# EAGLE design manual_power (EAGLE 9.3.0)
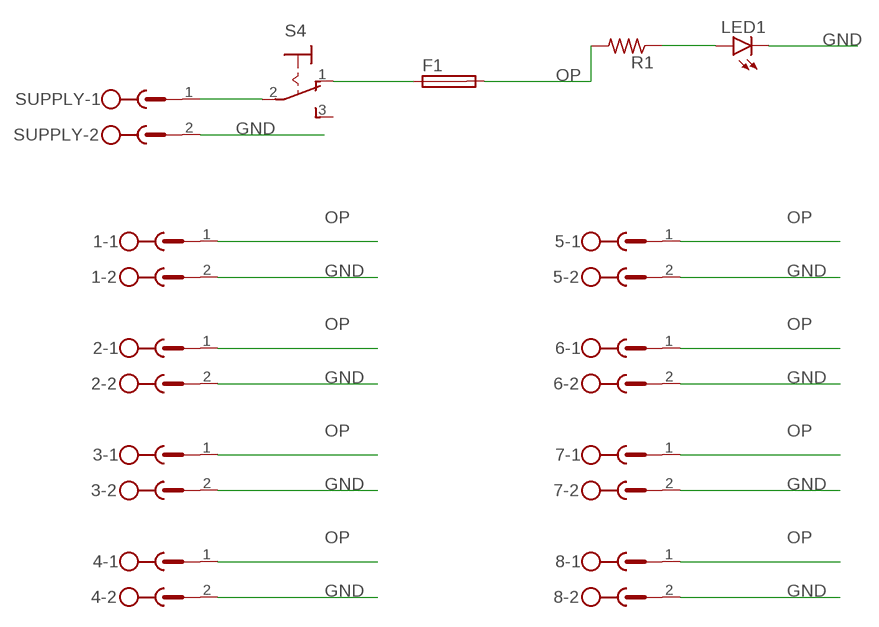
[diagram p0: schematic, sheet 1]

## Parts
1  MSTBV2  [MSTBV2]
2  MSTBV2  [MSTBV2]
3  MSTBV2  [MSTBV2]
4  MSTBV2  [MSTBV2]
5  MSTBV2  [MSTBV2]
6  MSTBV2  [MSTBV2]
7  MSTBV2  [MSTBV2]
8  MSTBV2  [MSTBV2]
F1  SH22  [SH22]
LED1  LED5MM  [LED5MM]
R1  R-US_0207/10  [0207/10]
S4  320-916  [320-916]
SUPPLY  MSTBV2  [MSTBV2]

## Nets
GND: 1.2 2.2 3.2 4.2 5.2 6.2 7.2 8.2 LED1.K(C) SUPPLY.2
N$1: S4.2(P) SUPPLY.1
N$2: LED1.A R1.1
N$5: F1.1 S4.1(O)
OP: 1.1 2.1 3.1 4.1 5.1 6.1 7.1 8.1 F1.2 R1.2
Unconnected: S4.3(S)

## Library data of the parts
1-8 SUPPLY = con-phoenix-500:MSTBV2: PHOENIX; OC_FARNELL: unknown; OC_NEWARK: unknown
F1 = fuse:SH22: FUSE HOLDER CS PFP30, Schukat; OC_FARNELL: unknown; OC_NEWARK: unknown
LED1 = led:LED: LED OSRAM: - CHIPLED LG R971, LG N971, LY N971, LG Q971, LY Q971, LO R971, LY R971 LH N974, LH R974 LS Q976, LO Q976, LY Q976 LO Q996 - Hyper CHIPLED LW Q18S LB Q993, LB Q99A, LB R99A - SideLED LS A670, LO A670, LY A670, LG A670, LP A670 LB A673, LV A673, LT A673, LW A673 LH A674 LY A675 LS A676, LA A676, LO A676, LY A676, LW A676 LS A679, LY A679, LG A679 - Hyper Micro SIDELED® LS Y876, LA Y876, LO Y876, LY Y876 LT Y87S - SmartLED LW L88C, LW L88S LB L89C, LB L89S, LG L890 LS L89K, LO L89K, LY L89K LS L896, LA L896, LO L896, LY L896 - TOPLED LS T670, LO T670, LY T670, LG T670, LP T670 LSG T670, LSP T670, LSY T670, LOP T670, LYG T670 LG T671, LOG T671, LSG T671 LB T673, LV T673, LT T673, LW T673 LH T674 LS T676, LA T676, LO T676, LY T676, LB T676, LH T676, LSB T676, LW T676 LB T67C, LV T67C, LT T67C, LS T67K, LO T67K, LY T67K, LW E67C LS E67B, LA E67B, LO E67B, LY E67B, LB E67C, LV E67C, LT E67C LW T67C LS T679, LY T679, LG T679 LS T770, LO T770, LY T770, LG T770, LP T770 LB T773, LV T773, LT T773, LW T773 LH T774 LS E675, LA E675, LY E675, LS T675 LS T776, LA T776, LO T776, LY T776, LB T776 LHGB T686 LT T68C, LB T68C - Hyper Mini TOPLED® LB M676 - Mini TOPLED Santana® LG M470 LS M47K, LO M47K, LY M47K Source: http://www.osram.convergy.de LUXEON: - LUMILED® LXK2-PW12-R00, LXK2-PW12-S00, LXK2-PW14-U00, LXK2-PW14-V00 LXK2-PM12-R00, LXK2-PM12-S00, LXK2-PM14-U00 LXK2-PE12-Q00, LXK2-PE12-R00, LXK2-PE12-S00, LXK2-PE14-T00, LXK2-PE14-U00 LXK2-PB12-K00, LXK2-PB12-L00, LXK2-PB12-M00, LXK2-PB14-N00, LXK2-PB14-P00, LXK2-PB14-Q00 LXK2-PR12-L00, LXK2-PR12-M00, LXK2-PR14-Q00, LXK2-PR14-R00 LXK2-PD12-Q00, LXK2-PD12-R00, LXK2-PD12-S00 LXK2-PH12-R00, LXK2-PH12-S00 LXK2-PL12-P00, LXK2-PL12-Q00, LXK2-PL12-R00 Source: www.luxeon.com KINGBRIGHT: KA-3528ASYC Source: www.kingbright.com
R1 = rcl:R-US_: RESISTOR, American symbol
S4 = switch:320-916: TOGGLE SWITCH distributor RS Components

## Board
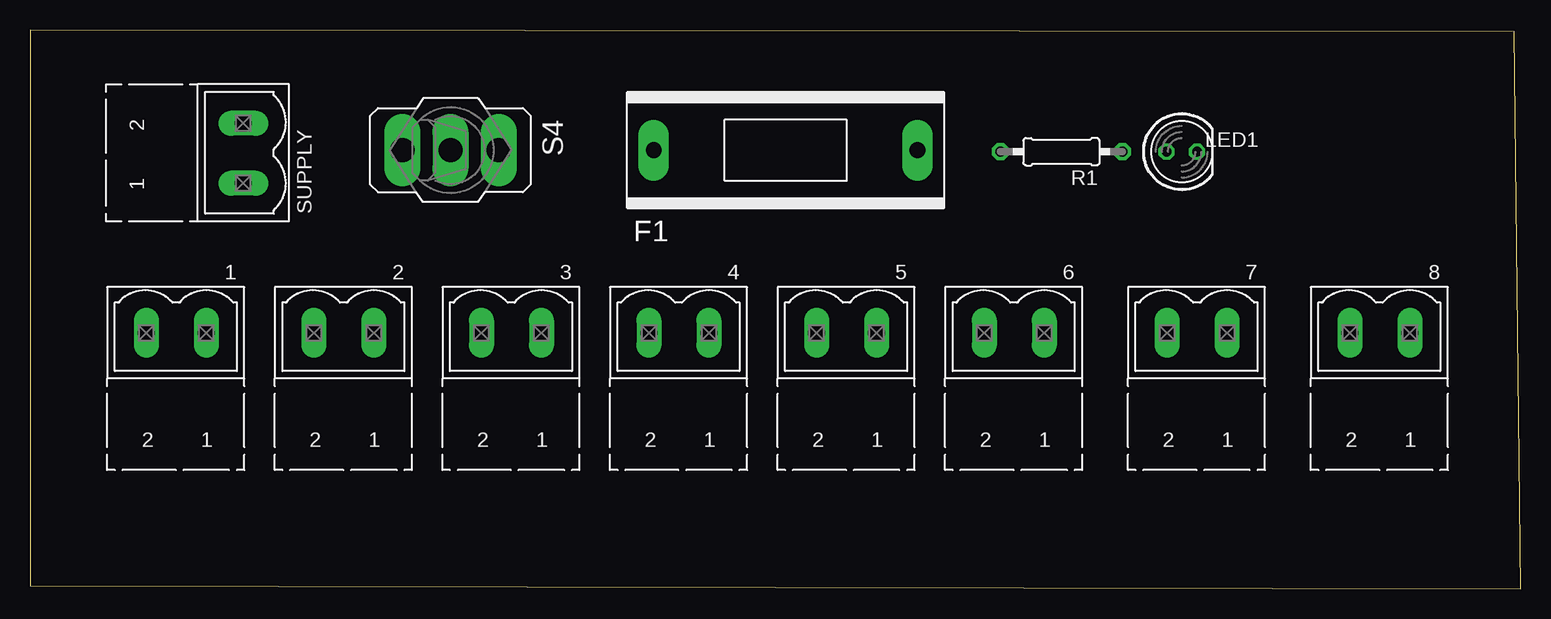
[diagram p1: board, top side]
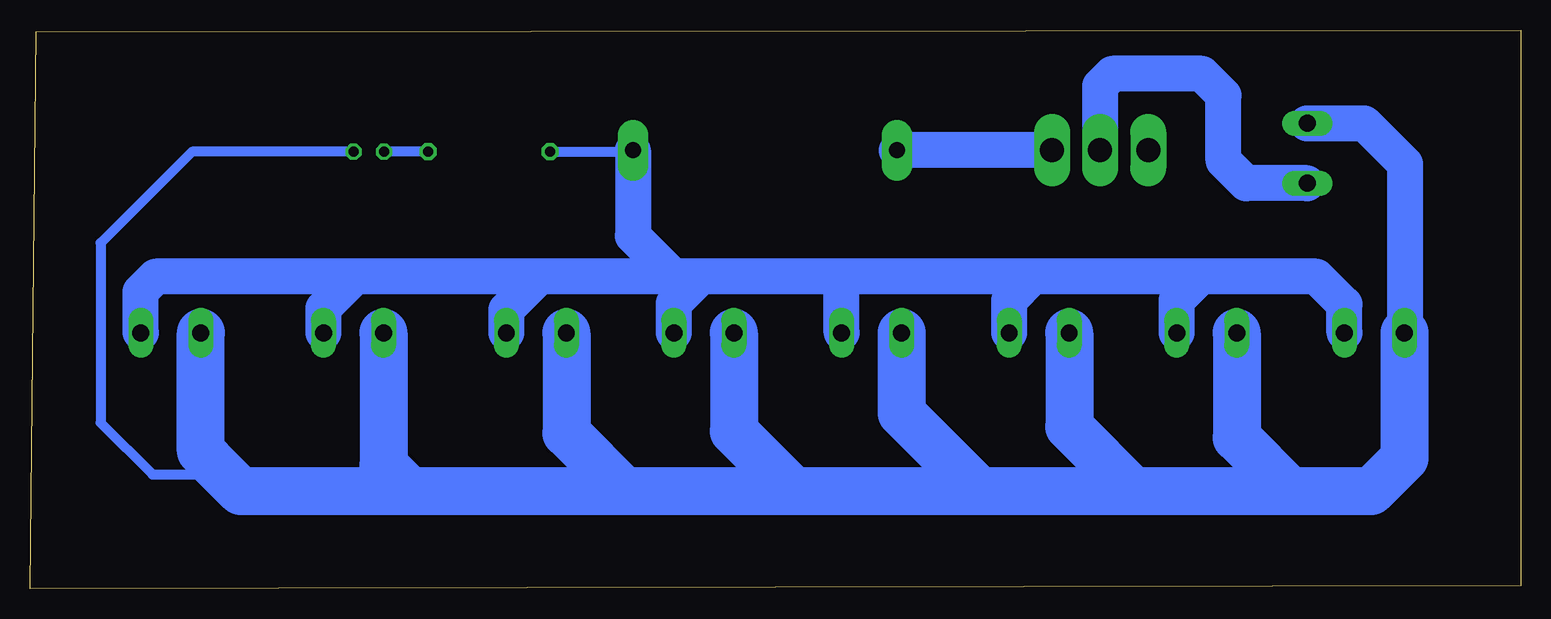
[diagram p2: board, bottom side, seen from below]

Size 124.26 x 46.6 mm. Coordinates in mm from the lower left corner, seen from the top.
Outline: 0,0.25 124.26,0 123.75,46.47 0,46.6 0,0.25
Copper layers (1*16): Top 0.035mm / dielectric 1.5mm / Bottom 0.035mm
Design rules "default": minimum track width 6mil, minimum drill 0.35mm, track to track 6mil, track to pad 6mil, pad to pad 6mil, via to via 6mil, smd to smd 6mil, copper to edge 40mil, drill to drill 6mil, minimum pad ring 10mil, minimum via ring 8mil, stop-mask expansion 4mil, vias tented up to drill 0mil, thermal gap 10mil

### Footprints (pad centres in the part's own frame; a part is rotated, then mirrored left to right if it is on the bottom)
MSTBV2 = drill 1.397 long: 1 -2.5,0; 2 2.5,0
SH22 = drill 1.321 pad 2.54 long: 1 -10.998,0; 2 10.998,0
LED5MM = drill 0.813 octagon: A -1.27,0; K 1.27,0
0207/10 = drill 0.813 pad 1.422 octagon: 1 -5.08,0; 2 5.08,0
320-916 = drill 2.007 long: 1 0,4.013; 2 0,0; 3 0,-4.013

### Placement (x,y rotation side)
1  12.19,21.34 180 top
2  26.16,21.34 180 top
3  40.13,21.34 180 top
4  54.1,21.34 180 top
5  68.07,21.34 180 top
6  82.04,21.34 180 top
7  97.28,21.34 180 top
8  112.52,21.34 180 top
F1  62.99,36.58 0 top
LED1  96.01,36.45 0 top
R1  85.98,36.45 180 top
S4  35.05,36.58 270 top
SUPPLY  17.78,36.32 90 top

### Tracks (layer width: path | path; a pad name or v marks a point on that pad's centre or on a via)
GND
  Bottom 0.813: LED1.K 110.74,36.45 118.36,28.83 118.36,13.84 114.05,9.53 111,9.53 | 111,9.53 109.47,9.53 | 110.02,11.47 109.35,10.8 109.35,11.18 | 111,9.53 109.35,11.18 | 108.59,11.94 109.35,11.18
  Bottom 3: SUPPLY.2 13.04,38.82 9.65,35.43 9.65,21.38 1.2
  Bottom 4: 1.2 9.69,10.88 12.45,8.13 19.18,8.13 | 19.18,8.13 32.26,8.13 | 32.26,8.13 45.09,8.13 | 45.09,8.13 60.58,8.13 | 60.58,8.13 74.68,8.13 | 110.02,11.47 8.2 | 109.35,10.8 106.68,8.13 92.58,8.13 | 6.2 79.54,12.99 74.68,8.13 | 5.2 65.57,13.12 60.58,8.13 | 4.2 51.6,14.65 45.09,8.13 | 3.2 37.63,13.5 32.26,8.13 | 2.2 23.66,12.61 19.18,8.13 | 74.68,8.13 92.58,8.13 | 92.58,8.13 94.78,10.33 7.2
N$1
  Bottom 3: S4.2 35.05,41.92 34.04,42.94 26.56,42.94 24.77,41.15 24.77,35.69 22.9,33.82 SUPPLY.1
N$2
  Bottom 0.813: R1.1 LED1.A
N$5
  Bottom 3: S4.1 F1.1
OP
  Bottom 0.813: F1.2 74.12,36.45 R1.2
  Bottom 3: 1.1 14.69,23.71 17.02,26.04 26.67,26.04 | 26.67,26.04 40.64,26.04 | 40.64,26.04 56.26,26.04 | 56.26,26.04 68.33,26.04 | 68.33,26.04 70.61,26.04 | 70.61,26.04 81.79,26.04 | 81.79,26.04 97.16,26.04 | 97.16,26.04 113.79,26.04 115.06,24.77 115.06,21.38 8.1 | 7.1 99.78,23.41 97.16,26.04 | 6.1 84.54,23.28 81.79,26.04 | 5.1 70.57,23.79 68.33,26.04 | 4.1 56.6,25.69 56.26,26.04 | 3.1 42.63,24.04 40.64,26.04 | 2.1 28.66,24.04 26.67,26.04 | F1.2 73.99,29.41 70.61,26.04